# EAGLE schematic Controller V1.0 (EAGLE 8.4.1)
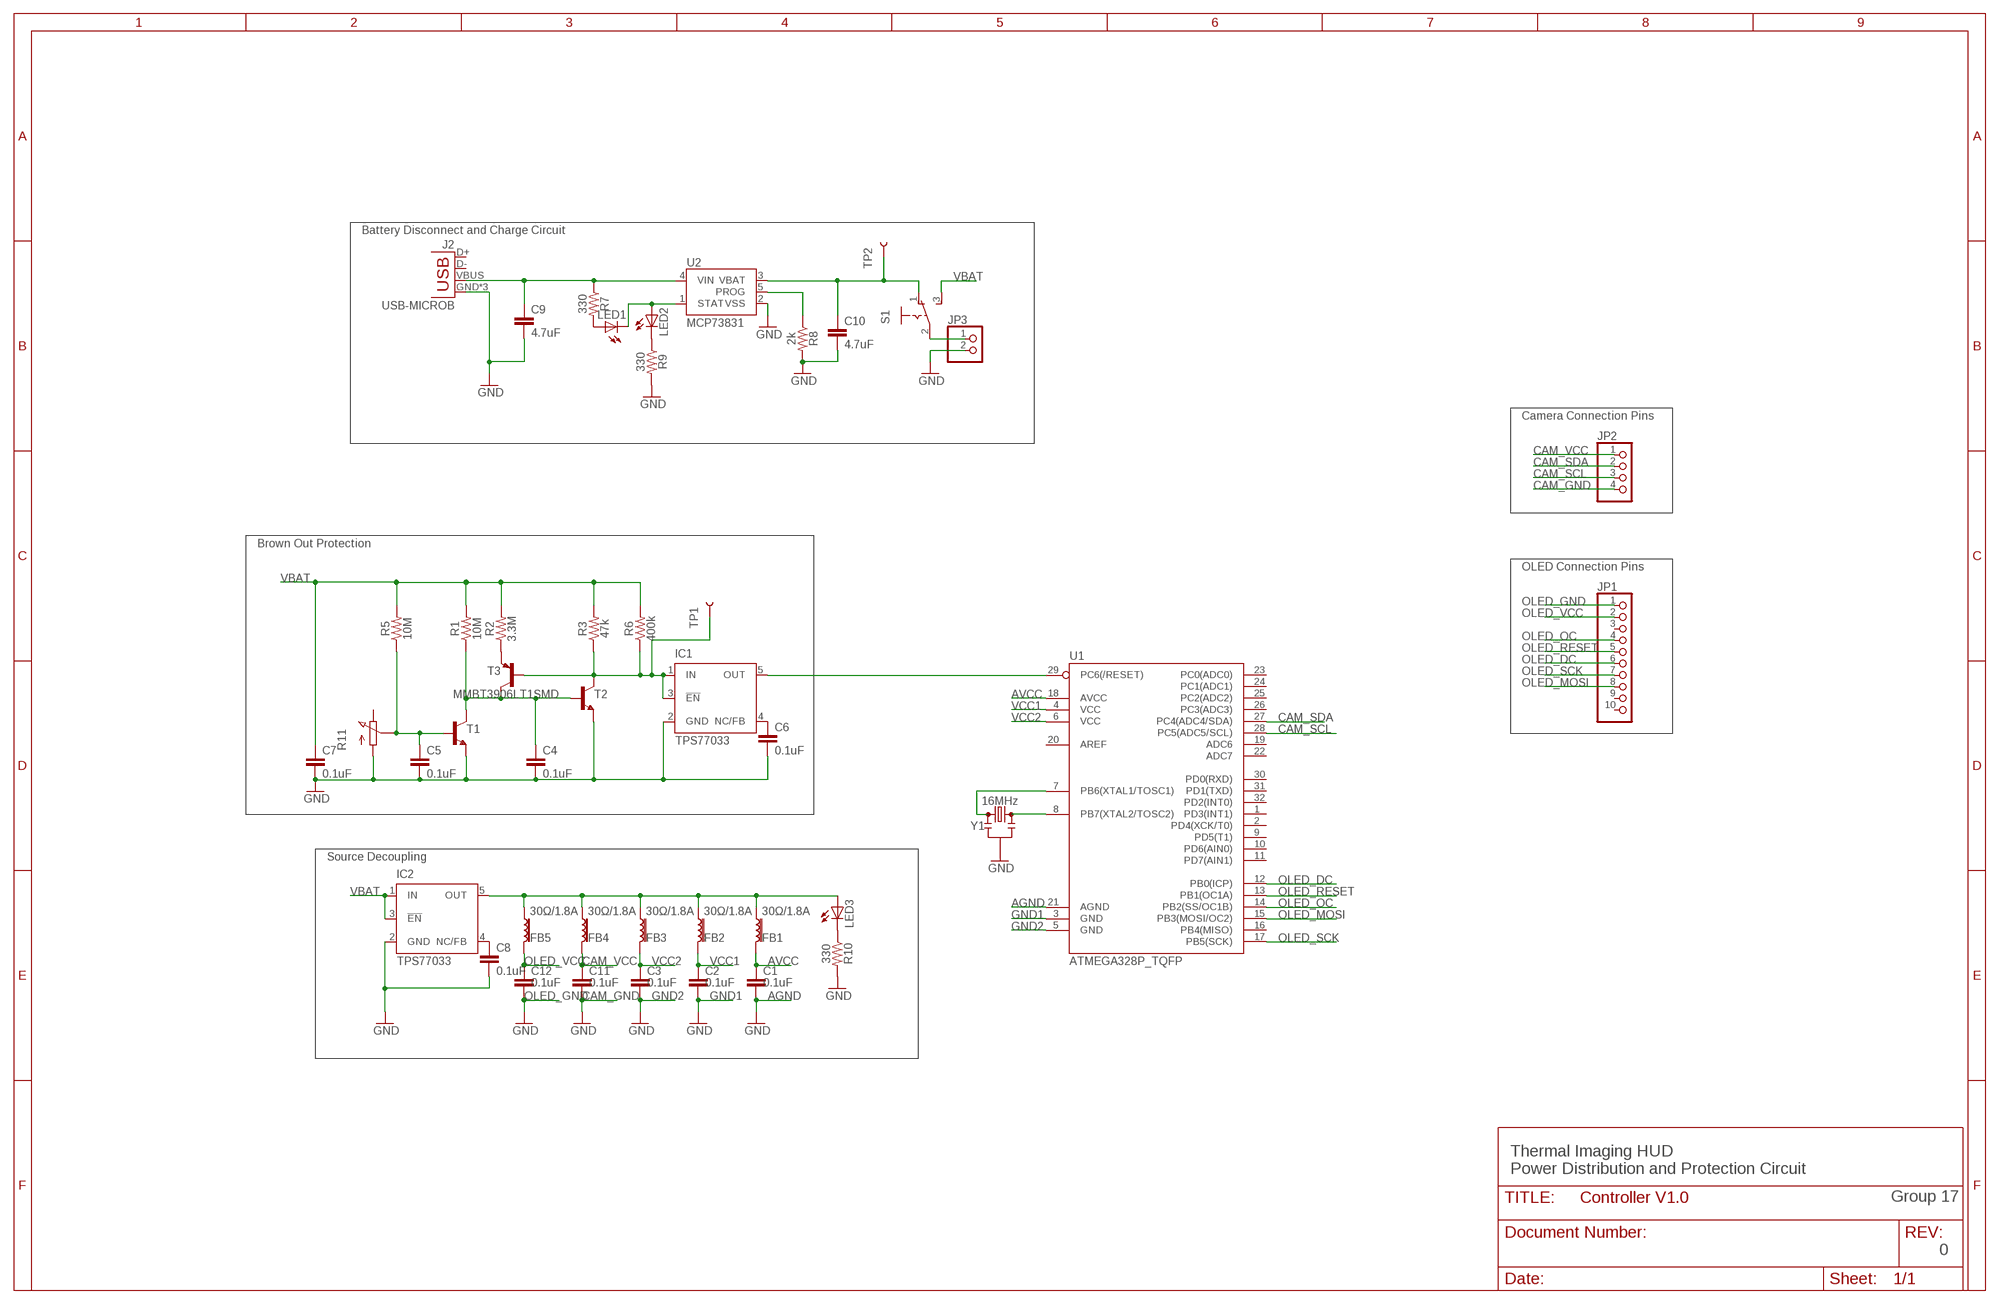
[diagram p0: schematic, sheet 1]

## Parts
C1  0.1uF  0.1UF-0603-25V-5%  [0603]
C2  0.1uF  0.1UF-0603-25V-5%  [0603]
C3  0.1uF  0.1UF-0603-25V-5%  [0603]
C4  0.1uF  0.1UF-0603-25V-5%  [0603]
C5  0.1uF  0.1UF-0603-25V-5%  [0603]
C6  0.1uF  0.1UF-0603-25V-5%  [0603]
C7  0.1uF  0.1UF-0603-25V-5%  [0603]
C8  0.1uF  0.1UF-0603-25V-5%  [0603]
C9  4.7uF  0.1UF-0603-25V-5%  [0603]
C10  4.7uF  0.1UF-0603-25V-5%  [0603]
C11  0.1uF  0.1UF-0603-25V-5%  [0603]
C12  0.1uF  0.1UF-0603-25V-5%  [0603]
FB1  30Ω/1.8A  FERRITE_BEAD-0603  [0603]
FB2  30Ω/1.8A  FERRITE_BEAD-0603  [0603]
FB3  30Ω/1.8A  FERRITE_BEAD-0603  [0603]
FB4  30Ω/1.8A  FERRITE_BEAD-0603  [0603]
FB5  30Ω/1.8A  FERRITE_BEAD-0603  [0603]
IC1  TPS77033  [SOT23-DBV]
IC2  TPS77033  [SOT23-DBV]
J2  USB-MICROB  [USB-MICROB]
JP1  PINHD-1X10/90  [1X10/90]
JP2  PINHD-1X4  [1X04]
JP3  PINHD-1X2/90  [1X02/90]
LED1  LS_T679-D2E2-1  [PLCC2]
LED2  LG_T679-E1F1-1  [PLCC2]
LED3  LG_T679-E1F1-1  [PLCC2]
R1  10M  10MOHM-0603-1/10W-5%  [0603]
R2  3.3M  10MOHM-0603-1/10W-5%  [0603]
R3  47k  10MOHM-0603-1/10W-5%  [0603]
R5  10M  10MOHM-0603-1/10W-5%  [0603]
R6  400k  10MOHM-0603-1/10W-5%  [0603]
R7  330  10MOHM-0603-1/10W-5%  [0603]
R8  2k  10MOHM-0603-1/10W-5%  [0603]
R9  330  10MOHM-0603-1/10W-5%  [0603]
R10  330  10MOHM-0603-1/10W-5%  [0603]
R11  PC25  [PC25]
S1  255SB  [255SB]
T1  MMBT3904LT1-NPN-SOT23-BEC  [SOT23-BEC]
T2  MMBT3904LT1-NPN-SOT23-BEC  [SOT23-BEC]
T3  MMBT3906LT1SMD  [SOT23-BEC]
TP1  TEST-POINT3X5  [PAD.03X.05]
TP2  TEST-POINT3X5  [PAD.03X.05]
U1  ATMEGA328P_TQFP  [TQFP32-08]
U2  MCP73831  [SOT23-5]
Y1  16MHz  RESONATOR-16MHZSMD_3.2X1.3  [RESONATOR-SMD-3.2X1.3]

## Nets
AGND: C1.2 U1.21(AGND) ; supply symbol labelled GND
AVCC: C1.1 FB1.2 U1.18(AVCC)
CAM_GND: C11.2 JP2.4 ; supply symbol labelled GND
CAM_SCL: JP2.3 U1.28(PC5(ADC5/SCL))
CAM_SDA: JP2.2 U1.27(PC4(ADC4/SDA))
CAM_VCC: C11.1 FB4.2 JP2.1
GND: C4.2 C5.2 C6.2 C7.2 C8.2 C9.2 C10.2 IC1.2(GND) IC2.2(GND) J2.GND J2.MT1(GND) J2.MT2(GND) JP3.2 R8.2 R9.2 R10.2 R11.A T1.E T2.E U2.2(VSS) Y1.2
GND1: C2.2 U1.3(GND) ; supply symbol labelled GND
GND2: C3.2 U1.5(GND) ; supply symbol labelled GND
LIPO_POS: JP3.1 S1.2(P)
N$1: IC1.1(IN) IC1.3(!EN) R3.1 R6.1 T2.C T3.B TP1.P$1
N$2: C5.1 R5.1 R11.S T1.B
N$3: IC1.5(OUT) U1.29(PC6(/RESET))
N$4: C4.1 R1.1 T1.C T2.B T3.C
N$5: R2.1 T3.E
N$6: LED1.C LED2.A U2.1(STAT)
N$7: C6.1 IC1.4(NC/FB)
N$8: FB1.1 FB2.1 FB3.1 FB4.1 FB5.1 IC2.5(OUT) LED3.A
N$9: C8.1 IC2.4(NC/FB)
N$10: LED1.A R7.2
N$11: C9.1 J2.VBUS R7.1 U2.4(VIN)
N$12: R8.1 U2.5(PROG)
N$13: C10.1 S1.1(O) TP2.P$1 U2.3(VBAT)
N$15: U1.7(PB6(XTAL1/TOSC1)) Y1.1
N$16: U1.8(PB7(XTAL2/TOSC2)) Y1.3
N$17: LED3.C R10.1
N$18: LED2.C R9.1
OLED_DC: JP1.6 U1.12(PB0(ICP))
OLED_GND: C12.2 JP1.1 ; supply symbol labelled GND
OLED_MOSI: JP1.8 U1.15(PB3(MOSI/OC2))
OLED_OC: JP1.4 U1.14(PB2(SS/OC1B))
OLED_RESET: JP1.5 U1.13(PB1(OC1A))
OLED_SCK: JP1.7 U1.17(PB5(SCK))
OLED_VCC: C12.1 FB5.2 JP1.2
VBAT: C7.1 IC2.1(IN) IC2.3(!EN) R1.2 R2.2 R3.2 R5.2 R6.2 S1.3(S)
VCC1: C2.1 FB2.2 U1.4(VCC)
VCC2: C3.1 FB3.2 U1.6(VCC)
Unconnected: J2.D+ J2.D- JP1.3 JP1.9 JP1.10 R11.E U1.1(PD3(INT1)) U1.2(PD4(XCK/T0)) U1.9(PD5(T1)) U1.10(PD6(AIN0)) U1.11(PD7(AIN1)) U1.16(PB4(MISO)) U1.19(ADC6) U1.20(AREF) U1.22(ADC7) U1.23(PC0(ADC0)) U1.24(PC1(ADC1)) U1.25(PC2(ADC2)) U1.26(PC3(ADC3)) U1.30(PD0(RXD)) U1.31(PD1(TXD)) U1.32(PD2(INT0))

## Notes on the sheet
- Battery Disconnect and Charge Circuit
- Camera Connection Pins
- Brown Out Protection
- OLED Connection Pins
- Source Decoupling
- Thermal Imaging HUD
  Power Distribution and Protection Circuit
- Group 17
- 0

## Library data of the parts
C1-C8 C11 C12 = SparkFun-Capacitors:0.1UF: 0.1µF ceramic capacitors A capacitor is a passive two-terminal electrical component used to store electrical energy temporarily in an electric field.; PROD_ID: CAP-08604
C9 C10 = SparkFun-Capacitors:0.1UF: 0.1µF ceramic capacitors A capacitor is a passive two-terminal electrical component used to store electrical energy temporarily in an electric field.; PROD_ID: CAP-08604; VALUE: 0.1uF
FB1-FB5 = SparkFun-Coils:FERRITE_BEAD: Ferrite Bead (blocks, cores, rings, chokes, etc.) Inductor with layers of ferrite used to suppress high frequencies. Often used to isolate high frequency noise. SparkFun Products: IOIO-OTG - V2.2 <https://www.sparkfun.com/products/13613> SparkFun SAMD21 Mini Breakout <https://www.sparkfun.com/products/13664> SparkFun 6 Degrees of Freedom Breakout - LSM6DS3 <https://www.sparkfun.com/products/13339> SparkFun SAMD21 Dev Breakout <https://www.sparkfun.com/products/13672>; PROD_ID: NDUC-07859
IC1 IC2 = texas:TPS770*: ULTRALOW-POWER 50-mA LOW-DROPOUT LINEAR REGULATORS 50-mA Low-Dropout Regulator Source: http://focus.ti.com/lit/ds/symlink/tps77001.pdf; MF: TEXAS INSTRUMENTS; MPN: TPS77033DBVT; OC_FARNELL: 8461570; OC_NEWARK: 77C1187
J2 = SparkFun-Retired:USB: USB Connectors USB-B-PTH is fully proven SKU : PRT-00139/CONN-08278 USB-miniB is fully proven SKU : PRT-00587 USB-A-PCB is untested. USB-A-H is throughly reviewed, but untested. Spark Fun Electronics SKU : PRT-00437 USB-B-SMT is throughly reviewed, but untested. Needs silkscreen touching up. USB-A-S has not been used/tested USB-MB-H has not been used/tested USB-MICROB has been used. CONN-09505; PROD_ID: CONN-09505
JP1 = pinhead:PINHD-1X10: PIN HEADER
JP2 = pinhead:PINHD-1X4: PIN HEADER
JP3 = pinhead:PINHD-1X2: PIN HEADER
LED1 = led:*_T679-?-1: LC TOPLED® Low Current LED Source: http://catalog.osram-os.com .. LG_LS_LY_T679_OBS.pdf; COLOR: super-red
LED2 LED3 = led:*_T679-?-1: LC TOPLED® Low Current LED Source: http://catalog.osram-os.com .. LG_LS_LY_T679_OBS.pdf; COLOR: green
R1 R5 = SparkFun-Resistors:10MOHM: RES-09327; PROD_ID: RES-08283
R2 R3 R6-R10 = SparkFun-Resistors:10MOHM: RES-09327; PROD_ID: RES-08283; VALUE: 10M
R11 = pot-vitrohm:PC25: VITROHM POTENTIOMETER; MF: CLAROSTAT; MPN: 308NPC25KS; OC_FARNELL: 1440998; OC_NEWARK: 03F7518
S1 = switch:255SB: SLIDING SWITCH Distributor Buerklin, 11G810
T1 T2 = transistor-neu-to92:*-NPN-: NPN Transistror
T3 = transistor-pnp:MMBT3906*: PNP Transistror
TP1 TP2 = SparkFun-Connectors:TEST-POINT: SparkFun Test Points Bare copper test points for troubleshooting or In-Circuit-Testing. These are used by our Production team for verifying production board runs using pogo-pins on test beds. SparkFun Products: SparkFun LSM9DS1 Breakout <https://www.sparkfun.com/products/13284> SparkFun PSOC <https://www.sparkfun.com/products/13714> SparkFun Load Cell Amplifier <https://www.sparkfun.com/products/13879>
U1 = SparkFun-IC-Microcontroller:ATMEGA328P_TQFP: Popular 328P in QFP Storefront component: ATmega328 - TQFP <https://www.sparkfun.com/products/13448> (COM-13448) Datasheet <http://www.sparkfun.com/datasheets/Components/SMD/ATMega328.pdf> SparkFun Products SparkFun RedBoard - Programmed with Arduino <https://www.sparkfun.com/products/12757> (DEV-12757) Arduino Pro Mini 328 - 5V/16MHz <https://www.sparkfun.com/products/11113> (DEV-11113) Arduino Pro Mini 328 - 3.3V/8MHz <https://www.sparkfun.com/products/11114> (DEV-11114) SparkFun OpenLog <https://www.sparkfun.com/products/13712> (DEV-13712) SparkFun MicroView - OLED Arduino Module <https://www.sparkfun.com/products/12923> (DEV-12923) SparkFun Digital Sandbox <https://www.sparkfun.com/products/12651> (DEV-12651) SparkFun PicoBoard <https://www.sparkfun.com/products/11888> (WIG-11888) Arduino Fio <https://www.sparkfun.com/products/10116> (DEV-10116) LilyPad Arduino 328 Main Board <https://www.sparkfun.com/products/13342> (DEV-13342) SparkFun RedStick <https://www.sparkfun.com/products/13741> (DEV-13741) LilyPad MP3 <https://www.sparkfun.com/products/11013> (DEV-11013) LilyPad Arduino SimpleSnap <https://www.sparkfun.com/products/10941> (DEV-10941) SparkFun Stepoko <https://www.sparkfun.com/products/13899> (ROB-13899) SparkFun Geiger Counter <https://www.sparkfun.com/products/11345> (SEN-11345) SparkFun EL Sequencer <https://www.sparkfun.com/products/12781> (COM-12781) Arduino Pro 328 - 5V/16MHz <https://www.sparkfun.com/products/10915> (DEV-10915) CryptoCape <https://www.sparkfun.com/products/12773> (DEV-12773) SparkFun IR Thermometer Evaluation Board - MLX90614 <https://www.sparkfun.com/products/10740> (SEN-10740) SparkFun RedBot Mainboard <https://www.sparkfun.com/products/12097> (ROB-12097) Arduino Pro 328 - 3.3V/8MHz <https://www.sparkfun.com/products/10914> (DEV-10914) SparkFun Block for Intel® Edison - Arduino <https://www.sparkfun.com/products/13036> (DEV-13036) SparkFun Simon Says - Surface Mount Soldering Kit <https://www.sparkfun.com/products/10935> (KIT-10935) SparkFun 7-Segment Serial Display - Red <https://www.sparkfun.com/products/11441> (COM-11441) SparkFun 7-Segment Serial Display - White <https://www.sparkfun.com/products/11629> (COM-11629) SparkFun 7-Segment Serial Display - Yellow <https://www.sparkfun.com/products/11443> (COM-11443) SparkFun 7-Segment Serial Display - Kelly Green <https://www.sparkfun.com/products/11440> (COM-11440) SparkFun 7-Segment Serial Display - Blue <https://www.sparkfun.com/products/11442> (COM-11442) SparkFun OpenSegment Serial Display - 20mm (Blue) <https://www.sparkfun.com/products/11647> (COM-11647) SparkFun OpenSegment Serial Display - 20mm (Green) <https://www.sparkfun.com/products/11646> (COM-11646) SparkFun OpenSegment Serial Display - 20mm (White) <https://www.sparkfun.com/products/11648> (COM-11648) SparkFun OpenSegment Serial Display - 20mm (Red) <https://www.sparkfun.com/products/11644> (COM-11644) SparkFun OpenSegment Serial Display - 20mm (Yellow) <https://www.sparkfun.com/products/11645> (COM-11645) SparkFun OpenSegment Shield <https://www.sparkfun.com/products/13190> (DEV-13190); PROD_ID: IC-09069
U2 = SparkFun-IC-Power:MCP73831: MCP73831T Li-Ion, Li-Pol Controller Miniature single cell, fully integrated Li-Ion, Li-polymer charge management controller Datasheet <http://ww1.microchip.com/downloads/en/DeviceDoc/20001984g.pdf> SparkFun Products: SparkFun ESP32 Thing <https://www.sparkfun.com/products/13907> SparkFun 9DoF Razor IMU M0 <https://www.sparkfun.com/products/14001>; PROD_ID: IC-09995
Y1 = SparkFun-Clocks:RESONATOR-16MHZ: 16MHz Resonator Digikey Example <http://www.digikey.com/product-detail/en/murata-electronics-north-america/CSTCE16M0V53-R0/490-1198-1-ND/584635> Frequency: 16MHz Frequency Stability: ±0.3% Frequency Tolerance: ±0.5% Capacitance: 15pF SparkFun Products SparkFun OpenLog <https://www.sparkfun.com/products/13712> SparkFun MicroView - OLED Arduino Module <https://www.sparkfun.com/products/12923>; PROD_ID: XTAL-08900